# EAGLE design main_board (EAGLE 8.7.0)
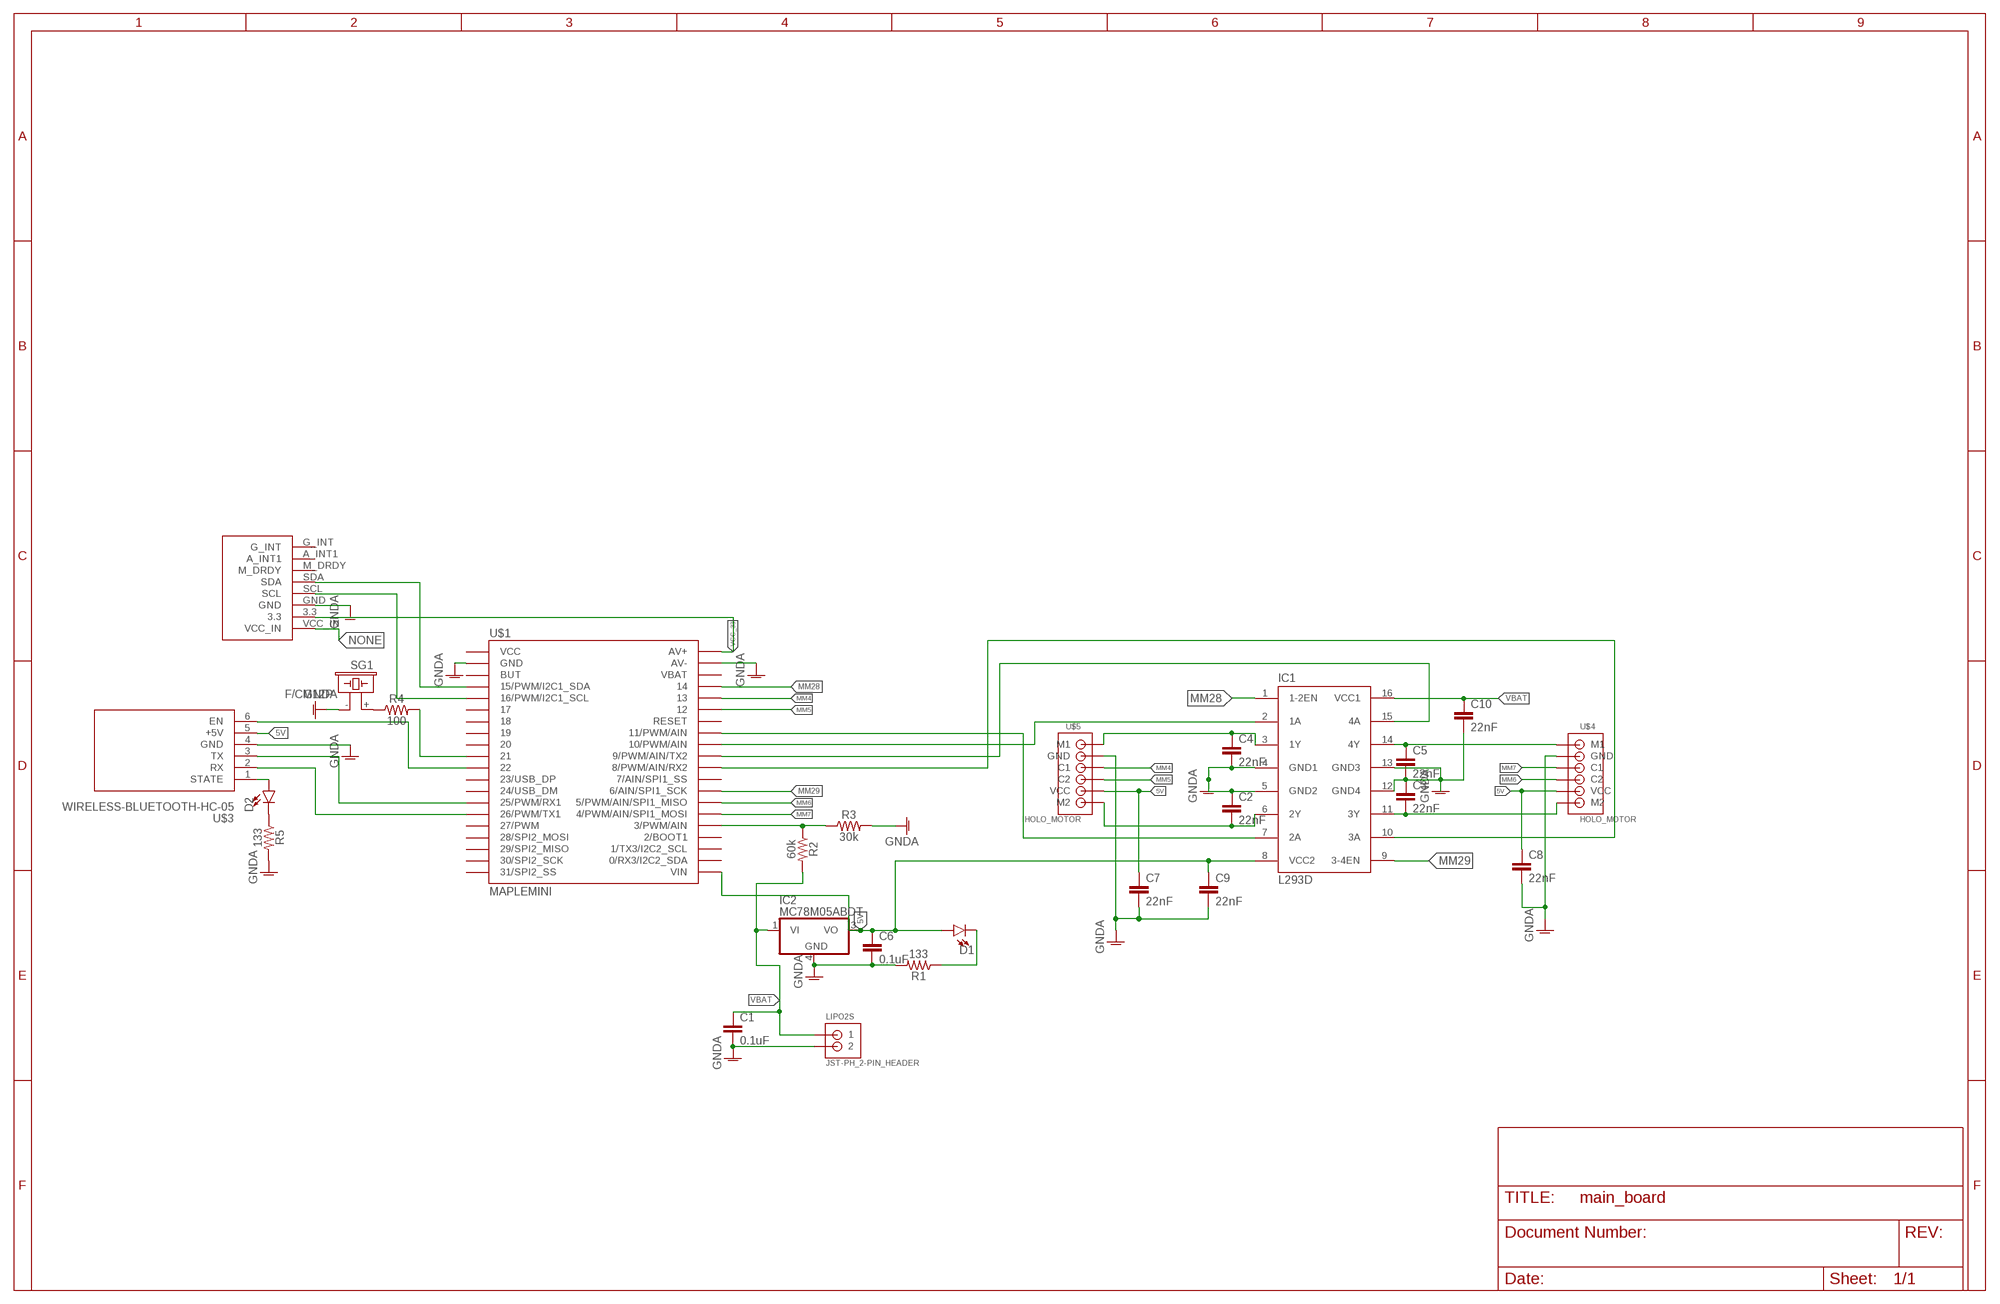
[diagram p0: schematic, sheet 1]

## Parts
C1  0.1uF  0.1UF-0603-25V-(+80/-20%)  [0603]
C2  22nF  22NF/22,000PF-0603-50V-10%  [0603]
C3  22nF  22NF/22,000PF-0603-50V-10%  [0603]
C4  22nF  22NF/22,000PF-0603-50V-10%  [0603]
C5  22nF  22NF/22,000PF-0603-50V-10%  [0603]
C6  0.1uF  0.1UF-0603-25V-(+80/-20%)  [0603]
C7  22nF  22NF/22,000PF-0603-50V-10%  [0603]
C8  22nF  22NF/22,000PF-0603-50V-10%  [0603]
C9  22nF  22NF/22,000PF-0603-50V-10%  [0603]
C10  22nF  22NF/22,000PF-0603-50V-10%  [0603]
D1  LED-FKIT-1206  [FKIT-LED-1206]
D2  LED-FKIT-1206  [FKIT-LED-1206]
IC1  L293D  [DIL16]
IC2  MC78M05ABDT  [DPACK_3]
LIPO2S  JST-PH_2-PIN_HEADER  [JST_B2B-PH_HEADER]
R1  133  0.27OHM-0603-1/10W-1%  [0603]
R2  60k  0.27OHM-0603-1/10W-1%  [0603]
R3  30k  0.27OHM-0603-1/10W-1%  [0603]
R4  100  0.27OHM-0603-1/10W-1%  [0603]
R5  133  0.27OHM-0603-1/10W-1%  [0603]
SG1  F/CM12P  [F/CM12P]
U$1  MAPLEMINI  [20-DIP]
U$3  WIRELESS-BLUETOOTH-HC-05  [WIRELESS-BLUETOOTH-HC-05]
U$4  HOLO_MOTOR  [HOLO_MOTOR]
U$5  HOLO_MOTOR  [HOLO_MOTOR]
U$6  GY-85  [GY-85]

## Nets
5V: C6.1 C7.1 C8.1 C9.1 D1.A IC1.8(VCC2) IC2.3(VO) U$1.21(VIN) U$3.5(+5V) U$4.5(VCC) U$5.5(VCC)
GNDA: C1.2 C2.1 C3.1 C4.2 C5.2 C6.2 C7.2 C8.2 C9.2 C10.2 IC1.4(GND1) IC1.5(GND2) IC1.12(GND4) IC1.13(GND3) IC2.4(GND) LIPO2S.P2 R1.2 R3.2 R5.2 SG1.- U$1.2(GND) U$1.39(AV-) U$3.4(GND) U$4.2(GND) U$5.2(GND) U$6.GND
MM4: U$1.36 U$5.3(C1)
MM5: U$1.35 U$5.4(C2)
MM6: U$1.27(5/PWM/AIN/SPI1_MISO) U$4.4(C2)
MM7: U$1.26(4/PWM/AIN/SPI1_MOSI) U$4.3(C1)
MM28: IC1.1(1-2EN) U$1.37
MM29: IC1.9(3-4EN) U$1.28(6/AIN/SPI1_SCK)
N$1: D1.C R1.1
N$2: R4.2 U$1.10
N$3: IC1.10(3A) U$1.30(8/PWM/AIN/RX2)
N$4: U$1.15(26/PWM/TX1) U$3.2(RX)
N$5: U$1.14(25/PWM/RX1) U$3.3(TX)
N$6: U$1.5(16/PWM/I2C1_SCL) U$6.SCL
N$7: C5.1 IC1.14(4Y) U$4.1(M1)
N$8: U$1.11 U$3.6(EN)
N$9: R2.1 R3.1 U$1.25(3/PWM/AIN)
N$10: IC1.7(2A) U$1.33(11/PWM/AIN)
N$11: IC1.2(1A) U$1.32(10/PWM/AIN)
N$12: IC1.15(4A) U$1.31(9/PWM/AIN/TX2)
N$13: U$1.4(15/PWM/I2C1_SDA) U$6.SDA
N$14: R4.1 SG1.+
N$15: C4.1 IC1.3(1Y) U$5.1(M1)
N$16: C3.2 IC1.11(3Y) U$4.6(M2)
N$17: C2.2 IC1.6(2Y) U$5.6(M2)
N$18: D2.A U$3.1(STATE)
N$19: D2.C R5.1
NONE: U$6.VCC_IN
VBAT: C1.1 C10.1 IC1.16(VCC1) IC2.1(VI) LIPO2S.P1 R2.2
VCC_33: U$1.40(AV+) U$6.3.3
Unconnected: U$1.1(VCC) U$1.3(BUT) U$1.6 U$1.7 U$1.8 U$1.9 U$1.12(23/USB_DP) U$1.13(24/USB_DM) U$1.16(27/PWM) U$1.17(28/SPI2_MOSI) U$1.18(29/SPI2_MISO) U$1.19(30/SPI2_SCK) U$1.20(31/SPI2_SS) U$1.22(0/RX3/I2C2_SDA) U$1.23(1/TX3/I2C2_SCL) U$1.24(2/BOOT1) U$1.29(7/AIN/SPI1_SS) U$1.34(RESET) U$1.38(VBAT) U$6.A_INT1 U$6.G_INT U$6.M_DRDY

## Library data of the parts
C1 C6 = SparkFun-Capacitors:0.1UF: 0.1µF ceramic capacitors A capacitor is a passive two-terminal electrical component used to store electrical energy temporarily in an electric field.; PROD_ID: CAP-00810
C2-C5 C7-C10 = SparkFun-Capacitors:22NF/22,000PF: 0.022uF/22nF/22,000pF ceramic capacitors A capacitor is a passive two-terminal electrical component used to store electrical energy temporarily in an electric field.; PROD_ID: CAP-07885
D1 D2 = SparkFun-LED:LED: LED (Generic) Standard schematic elements and footprints for 5mm, 3mm, 1206, and 0603 sized LEDs. Generic LEDs with no color specified.
IC1 = st-microelectronics:L293D: PUSH-PULL 4 CHANNEL DRIVER; MPN: L293D; OC_FARNELL: 9589619; OC_NEWARK: 56P8249
IC2 = linear:MC78M: 500 mA Positive Voltage Regulators Source: Data sheet <http://www.onsemi.com/pub_link/Collateral/MC78M00-D.PDF>
LIPO2S = srg:JST-PH_2-PIN_HEADER: 2-pin JST PH Shrouded Header, top entry P/N B2B-PH-K-S Mating connector PHR-2 Mating cable assembly: Sparkfun PRT-09914 <http://www.sparkfun.com/products/9914>
R1-R5 = SparkFun-Resistors:0.27OHM: 0.27Ω resistor A resistor is a passive two-terminal electrical component that implements electrical resistance as a circuit element. Resistors act to reduce current flow, and, at the same time, act to lower voltage levels within circuits. - Wikipedia; PROD_ID: RES-08787; VALUE: 0.27
SG1 = buzzer:F/CM12P: BUZZER Source: Buerklin; OC_FARNELL: unknown; OC_NEWARK: unknown
U$1 = maplemini:MAPLEMINI
U$3 = diy-modules:WIRELESS-BLUETOOTH-HC-05: Bluetooth Transceiver Module based on HC-05 board Tutorial is available here: https://arduino-info.wikispaces.com/BlueTooth-HC05-HC06-Modules-How-To Click here to find device on ebay.com <http://www.ebay.com/sch/hc-05+module+rs232>
U$4 U$5 = jst:HOLO_MOTOR
U$6 = rhoban:GY-85

## Board
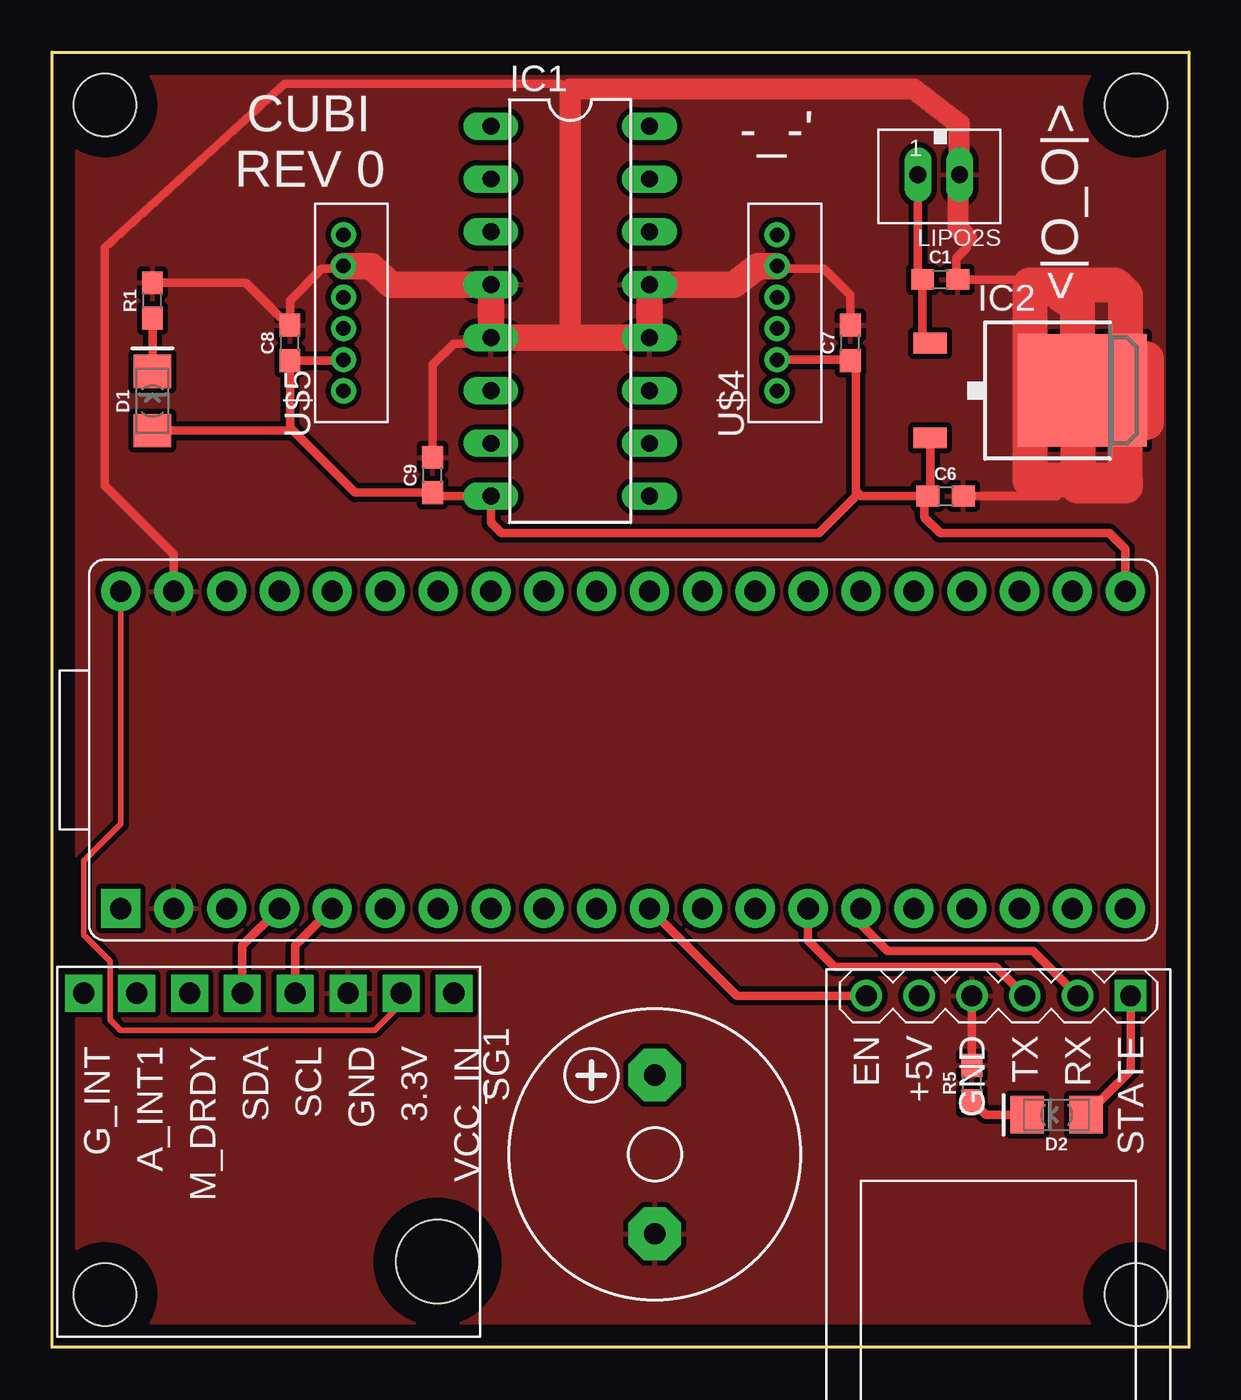
[diagram p1: board, top side]
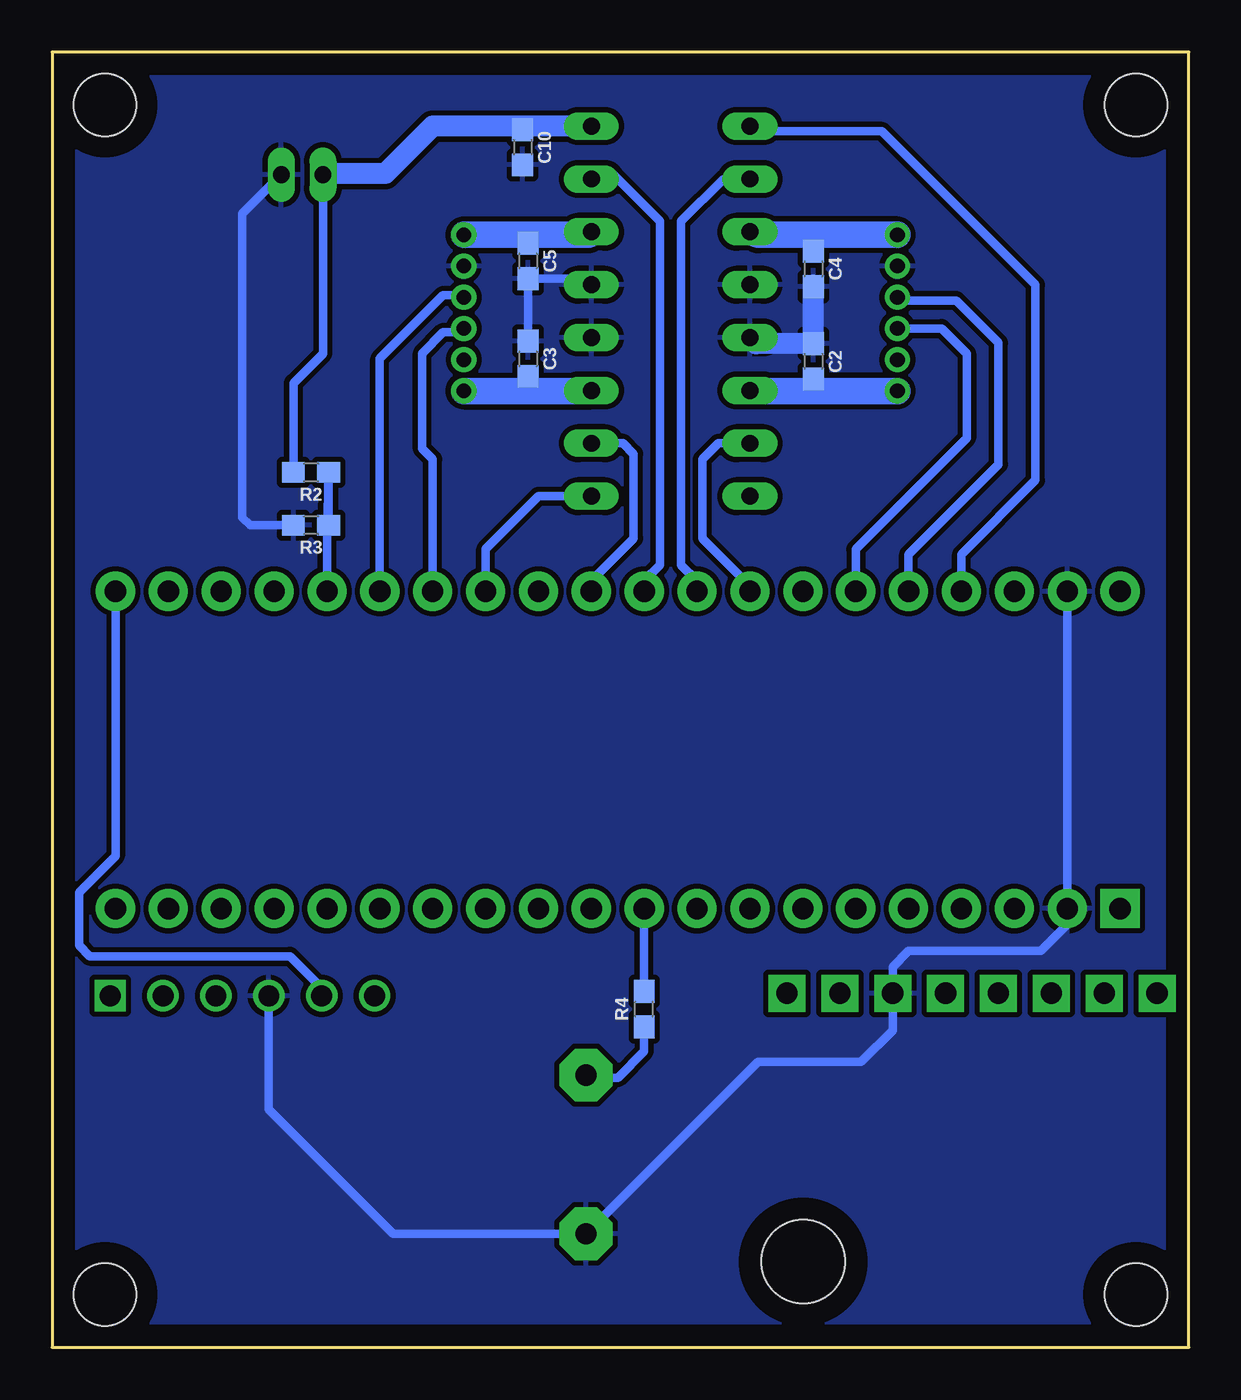
[diagram p2: board, bottom side, seen from below]

Size 54.61 x 62.23 mm. Coordinates in mm from the lower left corner, seen from the top.
Outline: 0,0 0,62.23 54.61,62.23 54.61,0 0,0
Copper layers (1*16): Top 0.035mm / dielectric 1.5mm / Bottom 0.035mm
Design rules "default": minimum track width 6mil, minimum drill 0.35mm, track to track 10mil, track to pad 10mil, pad to pad 10mil, via to via 10mil, smd to smd 6mil, copper to edge 40mil, drill to drill 6mil, minimum pad ring 10mil, minimum via ring 8mil, stop-mask expansion 4mil, vias tented up to drill 0mil, thermal gap 10mil
Holes 3 mm at 52.07,59.69 2.54,59.69 2.54,2.54 52.07,2.54

### Footprints (pad centres in the part's own frame; a part is rotated, then mirrored left to right if it is on the bottom)
0603 = smd 1.1 x 1: 1 -0.85,0; 2 0.85,0
FKIT-LED-1206 = smd 1.6 x 1.803: A -1.422,0; C 1.422,0
DIL16 = drill 0.813 long: 1 -8.89,-3.81; 2 -6.35,-3.81; 3 -3.81,-3.81; 4 -1.27,-3.81; 5 1.27,-3.81; 6 3.81,-3.81; 7 6.35,-3.81; 8 8.89,-3.81; 9 8.89,3.81; 10 6.35,3.81; 11 3.81,3.81; 12 1.27,3.81; 13 -1.27,3.81; 14 -3.81,3.81; 15 -6.35,3.81; 16 -8.89,3.81
DPACK_3 = smd 1 x 1.6: 1 -2.28,-4.8; 3 2.28,-4.8 | smd 5.4 x 6.2: 4 0,2.5
JST_B2B-PH_HEADER = drill 0.8 long: P1 1.075,0.048; P2 -0.925,0.048
F/CM12P = drill 1.016 pad 2.54 octagon: + 3.81,0; - -3.81,0
20-DIP = drill 1.016 pad 1.88 square: 1 -24.13,-7.62 | drill 1.016 pad 1.88: 2 -21.59,-7.62; 3 -19.05,-7.62; 4 -16.51,-7.62; 5 -13.97,-7.62; 6 -11.43,-7.62; 7 -8.89,-7.62; 8 -6.35,-7.62; 9 -3.81,-7.62; 10 -1.27,-7.62; 11 1.27,-7.62; 12 3.81,-7.62; 13 6.35,-7.62; 14 8.89,-7.62; 15 11.43,-7.62; 16 13.97,-7.62; 17 16.51,-7.62; 18 19.05,-7.62; 19 21.59,-7.62; 20 24.13,-7.62; 21 24.13,7.62; 22 21.59,7.62; 23 19.05,7.62; 24 16.51,7.62; 25 13.97,7.62; 26 11.43,7.62; 27 8.89,7.62; 28 6.35,7.62; 29 3.81,7.62; 30 1.27,7.62; 31 -1.27,7.62; 32 -3.81,7.62; 33 -6.35,7.62; 34 -8.89,7.62; 35 -11.43,7.62; 36 -13.97,7.62; 37 -16.51,7.62; 38 -19.05,7.62; 39 -21.59,7.62; 40 -24.13,7.62
WIRELESS-BLUETOOTH-HC-05 = drill 1 square: 1 -6.35,-17.145 | drill 1: 2 -3.81,-17.145; 3 -1.27,-17.145; 4 1.27,-17.145; 5 3.81,-17.145; 6 6.35,-17.145
HOLO_MOTOR = drill 0.7: 1 9,-1.3; 2 7.5,-1.3; 3 6,-1.3; 4 4.5,-1.3; 5 3,-1.3; 6 1.5,-1.3
GY-85 = drill 1.016 pad 1.778 square: 3.3 0,15.24; A_INT1 0,2.54; G_INT 0,0; GND 0,12.7; M_DRDY 0,5.08; SCL 0,10.16; SDA 0,7.62; VCC_IN 0,17.78 | hole 4: 12.9,17

### Placement (x,y rotation side)
C1  42.67,51.31 0 top
C2  18.03,47.37 270 bottom
C3  31.75,47.5 270 bottom
C4  18.03,51.82 270 bottom
C5  31.75,52.2 270 bottom
C6  42.93,40.89 0 top
C7  38.35,48.26 90 top
C8  11.43,48.26 90 top
C9  18.29,41.91 90 top
C10  32,57.66 270 bottom
D1  4.83,45.47 90 top
D2  48.26,11.18 180 top
IC1  24.89,49.78 270 top
IC2  46.99,45.97 270 top
LIPO2S  42.67,56.39 180 top
R1  4.83,50.29 90 top
R2  42.16,42.04 180 bottom
R3  42.16,39.5 180 bottom
R4  26.16,16.26 90 bottom
R5  44.2,12.7 90 top
SG1  28.96,9.27 90 top
U$1  27.43,28.7 0 top
U$3  45.47,-0.25 180 top
U$4  33.53,44.45 90 top
U$5  12.7,44.45 90 top
U$6  1.52,17.02 270 top

### Tracks (layer width: path | path; a pad name or v marks a point on that pad's centre or on a via)
5V
  Top 0.406: 13.97,47.24 13.97,47.48 | 13.97,47.48 13.97,47.5 13.88,47.41 C8.1 11.43,44.2 | 13.97,47.48 U$5.5 | U$4.5 38.31,47.45 C7.1 38.61,47.16 38.61,41.15 | 11.43,44.2 14.57,41.06 C9.1 18.45,40.89 IC1.8 21.08,39.62 21.59,39.12 36.83,39.12 38.61,40.89 38.61,41.15 | IC2.3 42.19,41.01 C6.1 | C6.1 38.86,40.89 38.61,41.15 | U$1.21 51.56,38.35 50.8,39.12 42.67,39.12 41.91,39.88 41.91,40.73 C6.1 | D1.A 11.28,44.04 11.43,44.2
  Bottom 0.406: U$1.21 51.56,23.62 53.31,21.87 53.31,19.3 52.81,18.8 43.18,18.8 41.66,17.27 U$3.5
GNDA
  Top 0.406: R5.2 U$3.4 | U$5.2 13.87,51.82 12.95,51.82 11.43,50.29 C8.2 11.43,49.02 9.31,51.14 R1.2 | C7.2 38.35,50.55 37.08,51.82 34.96,51.82 U$4.2 | C9.2 18.29,47.2 19.3,48.22 20.79,48.22 IC1.5 | C6.2 48.26,40.89 49.28,41.91 | IC2.4 49.28,45.76 49.28,45.72 49.28,45.47 | C1.2 47.75,51.31 48.01,51.05 | 43.52,56.27 LIPO2S.P2 | U$1.39 5.84,38.1 2.54,41.4 2.54,52.83 11.18,60.71 24.38,60.71 25.15,60.45 | 43.94,53.34 43.94,52.83 43.43,52.32 43.43,51.31
  Top 1.016: LIPO2S.P2 43.6,58.77 41.4,60.45 25.15,60.45 24.89,60.45 24.89,48.77 25.15,48.51 | 43.52,56.27 43.52,53.76 43.94,53.34
  Top 1.27: U$4.2 33.92,51.95 32.77,51.05 IC1.13 IC1.12 25.15,48.51 IC1.5 IC1.4 16.26,51.05 15.36,51.95 U$5.2
  Top 1.676: 49.28,45.72 49.28,50.04 48.51,50.55 | 48.51,50.55 48.01,51.05 51.05,51.05 51.56,50.55 51.56,47.5 | 51.56,41.4 51.56,41.66 | 51.56,41.66 51.56,47.5 | 51.56,47.5 52.58,47.5 52.58,44.45 49.28,44.45 49.28,41.66 | 49.28,41.66 49.28,41.4 51.31,41.4 51.56,41.66 | 51.56,41.66 49.28,41.66 | 49.28,41.66 46.99,41.66 46.99,51.05 48.26,51.05 48.51,50.8 48.51,50.55
  Bottom 0.406: U$1.39 U$1.2 5.84,20.32 7.11,19.05 13.46,19.05 14.22,18.29 U$6.GND 14.22,15.24 15.75,13.72 20.7,13.72 SG1.- 38.23,5.46 44.2,11.43 44.2,17.02 44.2,17.27 | C3.1 C5.2 29,51.35 IC1.13 | R3.2 45.09,39.5 45.47,39.88 45.47,54.47 LIPO2S.P2
  Bottom 1.016: 18.03,51.05 C4.2 C2.1 20.79,48.22 IC1.5
  pour Top: 0,0 0,62.23 54.61,62.23 54.61,0
  pour Bottom: 0,0 0,62.23 54.61,62.23 54.61,0
MM4
  Bottom 0.406: U$1.36 13.46,38.1 9.14,42.42 9.14,48.26 11.18,50.29 13.84,50.29 U$5.3
MM5
  Bottom 0.406: U$5.4 11.87,48.95 10.67,47.75 10.67,43.69 16,38.35 16,36.83 16.26,36.58 U$1.35
MM6
  Bottom 0.406: U$1.27 36.32,42.67 36.83,43.18 36.83,47.75 35.81,48.77 35.01,48.77 U$4.4
MM7
  Bottom 0.406: U$1.26 38.86,47.5 35.81,50.55 34.92,50.55 U$4.3
MM28
  Bottom 0.406: IC1.1 21.34,58.42 14.73,58.42 7.37,51.05 7.37,41.66 10.92,38.1 U$1.37
MM29
  Bottom 0.406: U$1.28 33.78,38.35 31.24,40.89 IC1.9
N$1
  Top 0.406: D1.C R1.1
N$2
  Bottom 0.406: R4.2 U$1.10
N$3
  Bottom 0.406: U$1.30 28.7,36.83 26.67,38.86 26.67,42.93 27.18,43.43 IC1.10
N$4
  Top 0.406: U$3.2 47.12,19.05 40.13,19.05 38.86,20.32 U$1.15
N$5
  Top 0.406: U$3.3 45.34,18.29 37.59,18.29 36.32,19.56 U$1.14
N$6
  Top 0.406: U$6.SCL 11.68,19.3 U$1.5
N$7
  Bottom 0.406: C5.1 31.39,53.05 30.99,53.45
  Bottom 1.27: U$4.1 30.99,53.45 28.85,53.45 IC1.14
N$8
  Top 0.406: U$3.6 32.89,16.89 U$1.11
N$9
  Bottom 0.406: U$1.25 41.4,39.16 R2.1 R3.1
N$10
  Bottom 0.406: U$1.33 21.08,36.58 23.37,38.86 23.37,42.67 22.61,43.43 IC1.7
N$11
  Bottom 0.406: U$1.32 23.62,36.83 24.38,37.59 24.38,54.1 22.35,56.13 IC1.2
N$12
  Bottom 0.406: U$1.31 26.16,36.83 25.4,37.59 25.4,54.1 27.69,56.39 28.45,56.39 IC1.15
N$13
  Top 0.406: U$6.SDA 9.14,19.3 U$1.4
N$14
  Bottom 0.406: R4.1 26.16,14.22 27.43,12.95 28.83,12.95 SG1.+
N$15
  Bottom 1.016: 20.68,53.45 18.14,53.45 18.03,53.34 C4.1
  Bottom 1.27: U$5.1 20.68,53.45 IC1.3
N$16
  Bottom 0.406: C3.2 31.75,46.2 31.5,45.95
  Bottom 1.27: U$4.6 31.5,45.95 28.73,45.95 IC1.11
N$17
  Bottom 1.016: 20.8,45.95 18.06,45.95 18.03,45.97 C2.2
  Bottom 1.27: U$5.6 20.8,45.95 IC1.6
N$18
  Top 0.406: U$3.1 51.82,13.31 D2.A
N$19
  Top 0.406: D2.C 44.87,11.18 R5.1
VBAT
  Top 0.406: IC2.1 41.82,48.62 C1.1 41.91,51.31 41.6,51.62 LIPO2S.P1
  Top 1.016: 28.79,58.59 IC1.16
  Bottom 0.406: 41.66,56.39 41.65,56.39 LIPO2S.P1 41.6,47.75 43.01,46.34 R2.2 | C10.1 29.12,58.51 28.96,58.67 | IC1.16 28.7,58.42 30.48,58.42 30.73,58.67 31.75,58.67 32,58.42 28.96,58.42 IC1.16
  Bottom 1.016: IC1.16 28.96,58.67 30.73,58.67 36.32,58.67 38.61,56.39 41.66,56.39
VCC_33
  Top 0.254: U$1.40 3.3,25.15 1.52,23.37 1.52,19.81 2.79,18.54 2.79,15.75 3.3,15.24 15.49,15.24 16.76,16.51 U$6.3.3

### Text on the board
tPlace: CUBI / REV 0 | -_-' | <|O_O|>